# EAGLE design gonzoCam (EAGLE 6.4)
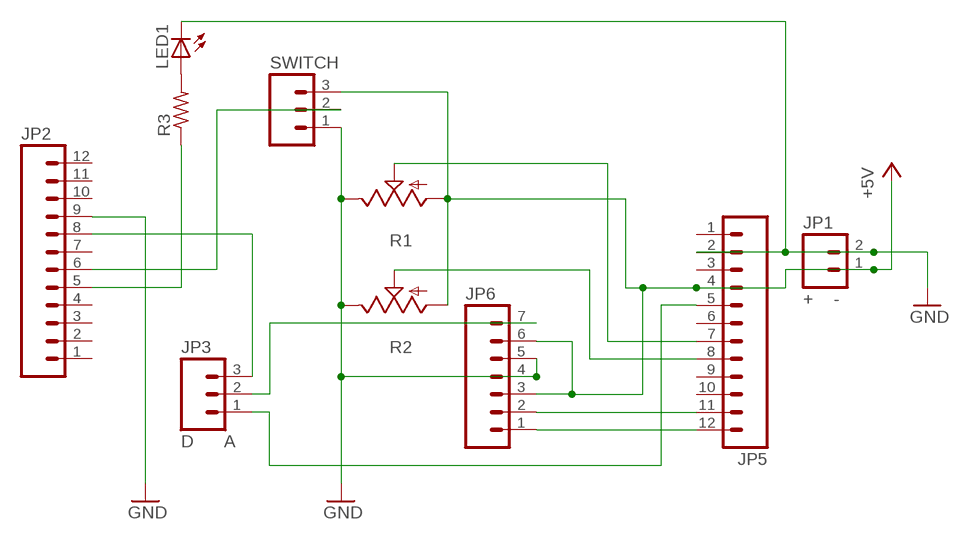
[diagram p0: schematic, sheet 1]

## Parts
JP1  + -  M02PTH  [1X02]
JP2  M12PTH  [1X12]
JP3  D A  M03PTH  [1X03]
JP5  M12PTH  [1X12]
JP6  M07  [1X07]
LED1  LED3MM  [LED3MM]
R1  TRIM_US-CA6V  [CA6V]
R2  TRIM_US-CA6V  [CA6V]
R3  R-US_0204/5  [0204/5]
SWITCH  M03PTH  [1X03]

## Nets
+5V: JP1.1 JP5.4 JP6.3 JP6.6 R1.A R2.A SWITCH.3
GND: JP1.2 JP2.9 JP5.2 JP6.4 JP6.5 LED1.K(C) R1.E R2.E SWITCH.1
N$1: JP2.6 SWITCH.2
N$2: JP2.5 R3.1
N$3: JP5.11 JP6.2
N$4: JP5.12 JP6.1
N$5: JP3.2 JP6.7
N$6: JP5.8 R2.S
N$7: JP5.7 R1.S
N$8: LED1.A R3.2
N$9: JP2.8 JP3.3
N$10: JP3.1 JP5.5
Unconnected: JP2.1 JP2.2 JP2.3 JP2.4 JP2.7 JP2.10 JP2.11 JP2.12 JP5.1 JP5.3 JP5.6 JP5.9 JP5.10

## Library data of the parts
JP1 = SparkFun-Connectors:M02: Standard 2-pin 0.1" header. Use with - straight break away headers ( PRT-00116) - right angle break away headers (PRT-00553) - swiss pins (PRT-00743) - machine pins (PRT-00117) - female headers (PRT-00115) Molex polarized connector foot print use with: PRT-08233 with associated crimp pins and housings. 2.54_SCREWTERM for use with PRT-10571. 3.5mm Screw Terminal footprints for PRT-08084 5mm Screw Terminal footprints for use with PRT-08433
JP2 JP5 = SparkFun-Connectors:M12: Header 12 Standard 12-pin 0.1" header. Use with straight break away headers (SKU : PRT-00116), right angle break away headers (PRT-00553), swiss pins (PRT-00743), machine pins (PRT-00117), and female headers (PRT-00115).
JP3 SWITCH = SparkFun-Connectors:M03: Header 3 Standard 3-pin 0.1" header. Use with straight break away headers (SKU : PRT-00116), right angle break away headers (PRT-00553), swiss pins (PRT-00743), machine pins (PRT-00117), and female headers (PRT-00115). Molex polarized connector foot print use with SKU : PRT-08232 with associated crimp pins and housings.
JP6 = SparkFun-Connectors:M07: Header 7 Standard 7-pin 0.1" header. Use with straight break away headers (SKU : PRT-00116), right angle break away headers (PRT-00553), swiss pins (PRT-00743), machine pins (PRT-00117), and female headers (PRT-00115). NOTES ON THE VARIANTS LOCK and LOCK_LONGPADS... This footprint was designed to help hold the alignment of a through-hole component (i.e. 7-pin header) while soldering it into place. You may notice that each hole has been shifted either up or down by 0.005 of an inch from it's more standard position (which is usually a perfectly straight line). This slight alteration caused the pins (the squares in the middle) to touch the edges of the holes. Because they are alternating, it causes a "brace" to hold the header in place. 0.005 has proven to be the perfect amount of "off-center" position when using our standard breakaway headers. Although looks a little odd when you look at the bare footprint, once you have a header in there, the alteration is very hard to notice. Also, if you push a header all the way into place, it is covered up entirely on the bottom side. This idea of altering the position of holes to aid alignment will be further integrated into the Sparkfun Library for other footprints. It can help hold any component with 3 or more connection pins.
LED1 = adafruit:LED: LED OSRAM: - CHIPLED LG R971, LG N971, LY N971, LG Q971, LY Q971, LO R971, LY R971 LH N974, LH R974 LS Q976, LO Q976, LY Q976 LO Q996 - Hyper CHIPLED LW Q18S LB Q993, LB Q99A, LB R99A - SideLED LS A670, LO A670, LY A670, LG A670, LP A670 LB A673, LV A673, LT A673, LW A673 LH A674 LY A675 LS A676, LA A676, LO A676, LY A676, LW A676 LS A679, LY A679, LG A679 - Hyper Micro SIDELED® LS Y876, LA Y876, LO Y876, LY Y876 LT Y87S - SmartLED LW L88C, LW L88S LB L89C, LB L89S, LG L890 LS L89K, LO L89K, LY L89K LS L896, LA L896, LO L896, LY L896 - TOPLED LS T670, LO T670, LY T670, LG T670, LP T670 LSG T670, LSP T670, LSY T670, LOP T670, LYG T670 LG T671, LOG T671, LSG T671 LB T673, LV T673, LT T673, LW T673 LH T674 LS T676, LA T676, LO T676, LY T676, LB T676, LH T676, LSB T676, LW T676 LB T67C, LV T67C, LT T67C, LS T67K, LO T67K, LY T67K, LW E67C LS E67B, LA E67B, LO E67B, LY E67B, LB E67C, LV E67C, LT E67C LW T67C LS T679, LY T679, LG T679 LS T770, LO T770, LY T770, LG T770, LP T770 LB T773, LV T773, LT T773, LW T773 LH T774 LS E675, LA E675, LY E675, LS T675 LS T776, LA T776, LO T776, LY T776, LB T776 LHGB T686 LT T68C, LB T68C - Hyper Mini TOPLED® LB M676 - Mini TOPLED Santana® LG M470 LS M47K, LO M47K, LY M47K Source: http://www.osram.convergy.de/
R1 R2 = pot:TRIM_US-: POTENTIOMETER
R3 = resistor:R-US_: RESISTOR, American symbol

## Net classes
0 default: width 0.305 mm, drill 0.508 mm, clearance 0.254 mm

## Board
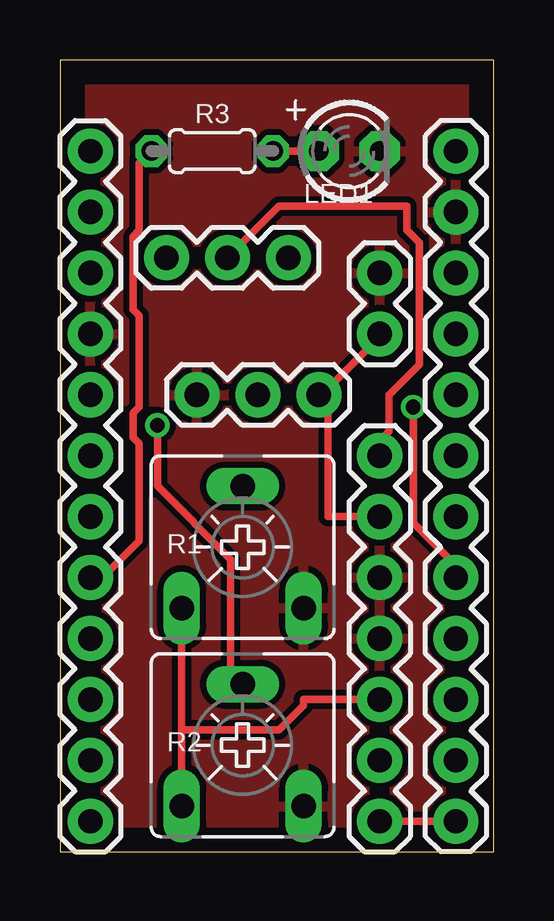
[diagram p1: board, top side]
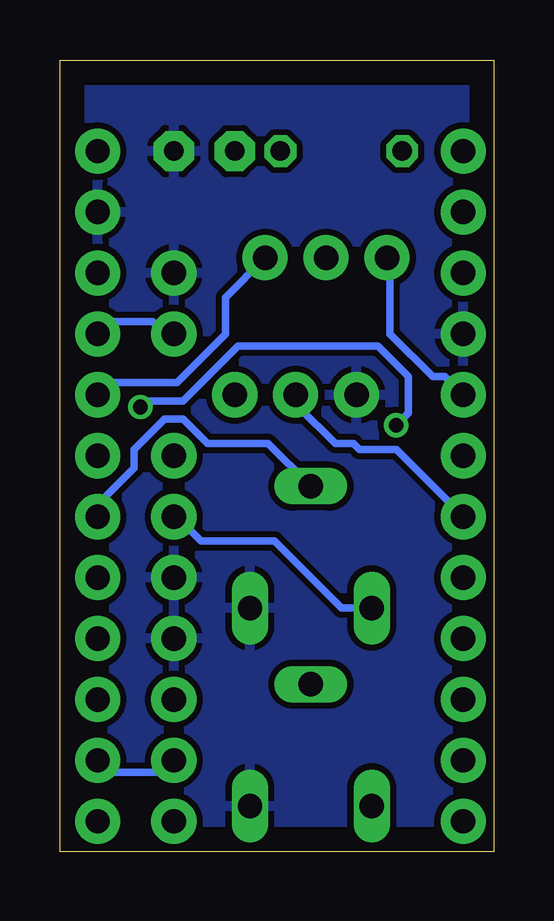
[diagram p2: board, bottom side, seen from below]

Size 18.09 x 33.01 mm. Coordinates in mm from the lower left corner, seen from the top.
Outline: 0,0 18.09,0 18.09,33.01 0,33.01 0,0
Copper layers (1*16): Top 0.035mm / dielectric 1.5mm / Bottom 0.035mm
Design rules "default": minimum track width 10mil, minimum drill 24mil, track to track 8mil, track to pad 8mil, pad to pad 8mil, via to via 8mil, smd to smd 8mil, copper to edge 40mil, drill to drill 8mil, minimum pad ring 10mil, minimum via ring 8mil, stop-mask expansion 4mil, vias tented up to drill 0mil, thermal gap 10mil

### Footprints (pad centres in the part's own frame; a part is rotated, then mirrored left to right if it is on the bottom)
1X02 = drill 1.016 pad 1.88: 1 0,0; 2 2.54,0
1X12 = drill 1.016 pad 1.88: 1 0,0; 2 2.54,0; 3 5.08,0; 4 7.62,0; 5 10.16,0; 6 12.7,0; 7 15.24,0; 8 17.78,0; 9 20.32,0; 10 22.86,0; 11 25.4,0; 12 27.94,0
1X03 = drill 1.016 pad 1.88: 1 0,0; 2 2.54,0; 3 5.08,0
1X07 = drill 1.016 pad 1.88: 1 0,0; 2 2.54,0; 3 5.08,0; 4 7.62,0; 5 10.16,0; 6 12.7,0; 7 15.24,0
LED3MM = drill 0.813 pad 1.676 octagon: A -1.27,0; K 1.27,0
CA6V = drill 1.016 long: A -2.54,-2.54; E 2.54,-2.54; S 0,2.54
0204/5 = drill 0.813 octagon: 1 -2.54,0; 2 2.54,0

### Placement (x,y rotation side)
JP1  13.34,21.59 90 top
JP2  1.27,1.27 90 top
JP3  9.53,24.77 180 top
JP5  16.51,29.21 270 top
JP6  13.34,1.27 90 top
LED1  12.06,29.21 0 top
R1  7.62,12.7 0 top
R2  7.62,4.45 0 top
R3  6.35,29.21 0 top
SWITCH  5.71,19.05 0 top

### Tracks (layer width: path | path; a pad name or v marks a point on that pad's centre or on a via)
+5V
  Top 0.305: 11.18,19.3 13.21,21.34 13.21,21.59 JP1.1 | 11.18,19.3 10.92,19.05 SWITCH.3 11.18,19.3 | JP6.6 11.18,13.97 11.18,19.3 | R1.A 5.08,5.08 | 5.08,5.08 R2.A | JP6.3 10.16,6.35 10.16,6.1 9.14,5.08 5.08,5.08
  Bottom 0.305: JP5.4 16,22.1 14.22,22.1 13.72,21.59 JP1.1 | R1.A 6.35,10.16 9.14,12.95 12.19,12.95 13.21,13.97 JP6.6
GND
  pour Top: -0.64,33.66 18.41,33.66 18.41,31.75 18.41,-0.64 -0.64,-0.64
  pour Bottom: -0.64,33.66 -0.64,-0.64 18.41,-0.64 18.41,33.66
N$1
  Bottom 0.305: JP2.6 4.06,16.76 5.59,16.76 5.84,17.02 6.6,17.02 8.13,18.54 8.13,19.05 SWITCH.2
N$2
  Top 0.305: R3.1 3.3,28.7 3.3,25.91 3.05,25.65 3.05,22.61 3.3,22.35 3.3,18.54 3.05,18.29 3.05,17.27 3.3,17.02 3.3,12.95 1.78,11.43 JP2.5
N$3
  Bottom 0.305: JP5.11 16,3.3 13.97,3.3 13.46,3.81 JP6.2
N$4
  Top 0.305: JP5.12 JP6.1
N$5
  Top 0.305: JP3.2 9.14,26.92 14.48,26.92 14.48,25.91 14.99,25.4 14.99,20.32 13.72,19.05 13.72,17.53 13.46,17.27 13.46,16.51 JP6.7
N$6  (via drill 0.61)
  Top 0.305: v4.06,17.78 4.06,15.24 7.11,12.19 7.11,7.62 7.62,7.11 R2.S | v14.73,18.54 14.73,13.72 16.51,11.94 JP5.8
  Bottom 0.305: v4.06,17.78 3.56,18.29 3.56,19.81 4.83,21.08 10.67,21.08 12.95,18.8 14.48,18.8 v14.73,18.54
N$7
  Bottom 0.305: R1.S 9.4,17.02 11.94,17.02 12.95,18.03 13.72,18.03 14.99,16.76 14.99,16 16.51,14.48 JP5.7
N$8
  Top 0.305: LED1.A R3.2
N$9
  Bottom 0.305: JP2.8 2.03,19.81 2.54,19.81 4.32,21.59 4.32,24.64 JP3.3
N$10
  Bottom 0.305: JP3.1 11.18,23.11 11.18,21.59 13.21,19.56 16,19.56 JP5.5